# Altium schematic sheet ETHERNET.SchDoc: {Наименование}
size 420 x 297 mm; ApprovedBy: {Утвердил}; CheckedBy: {Проверил}; DrawnBy: {Разраб.}; DocumentNumber: АБВГ 123456.789 00; SheetNumber: 10; SheetTotal: {}; Scale: {Мш.}; PageSetup: Record=PageOptions|CenterHorizontal=False|CenterVertical=False|PrintScale=0.95|XCorrection=0.00|YCorrection=0.00|PrintKind=1|BorderSize=5000000|LeftOffset=0|BottomOffset=0|Orientation=1|PaperLength=1000|PaperWidth=1000|Scale=100|PaperSource=15|PrintQuality=600|MediaType=1|DitherType=10|PaperKind=A4|PrintScaleMode=1; ProcessInspection: {Т.контр.}; Mass: {М.}; NormInspection: {Н.контр.}; Letter1Column: {}; Letter2Column: {}; Letter3Column: {}; DocumentType: {Документ}; Rule: PcbType=ProtelPcb
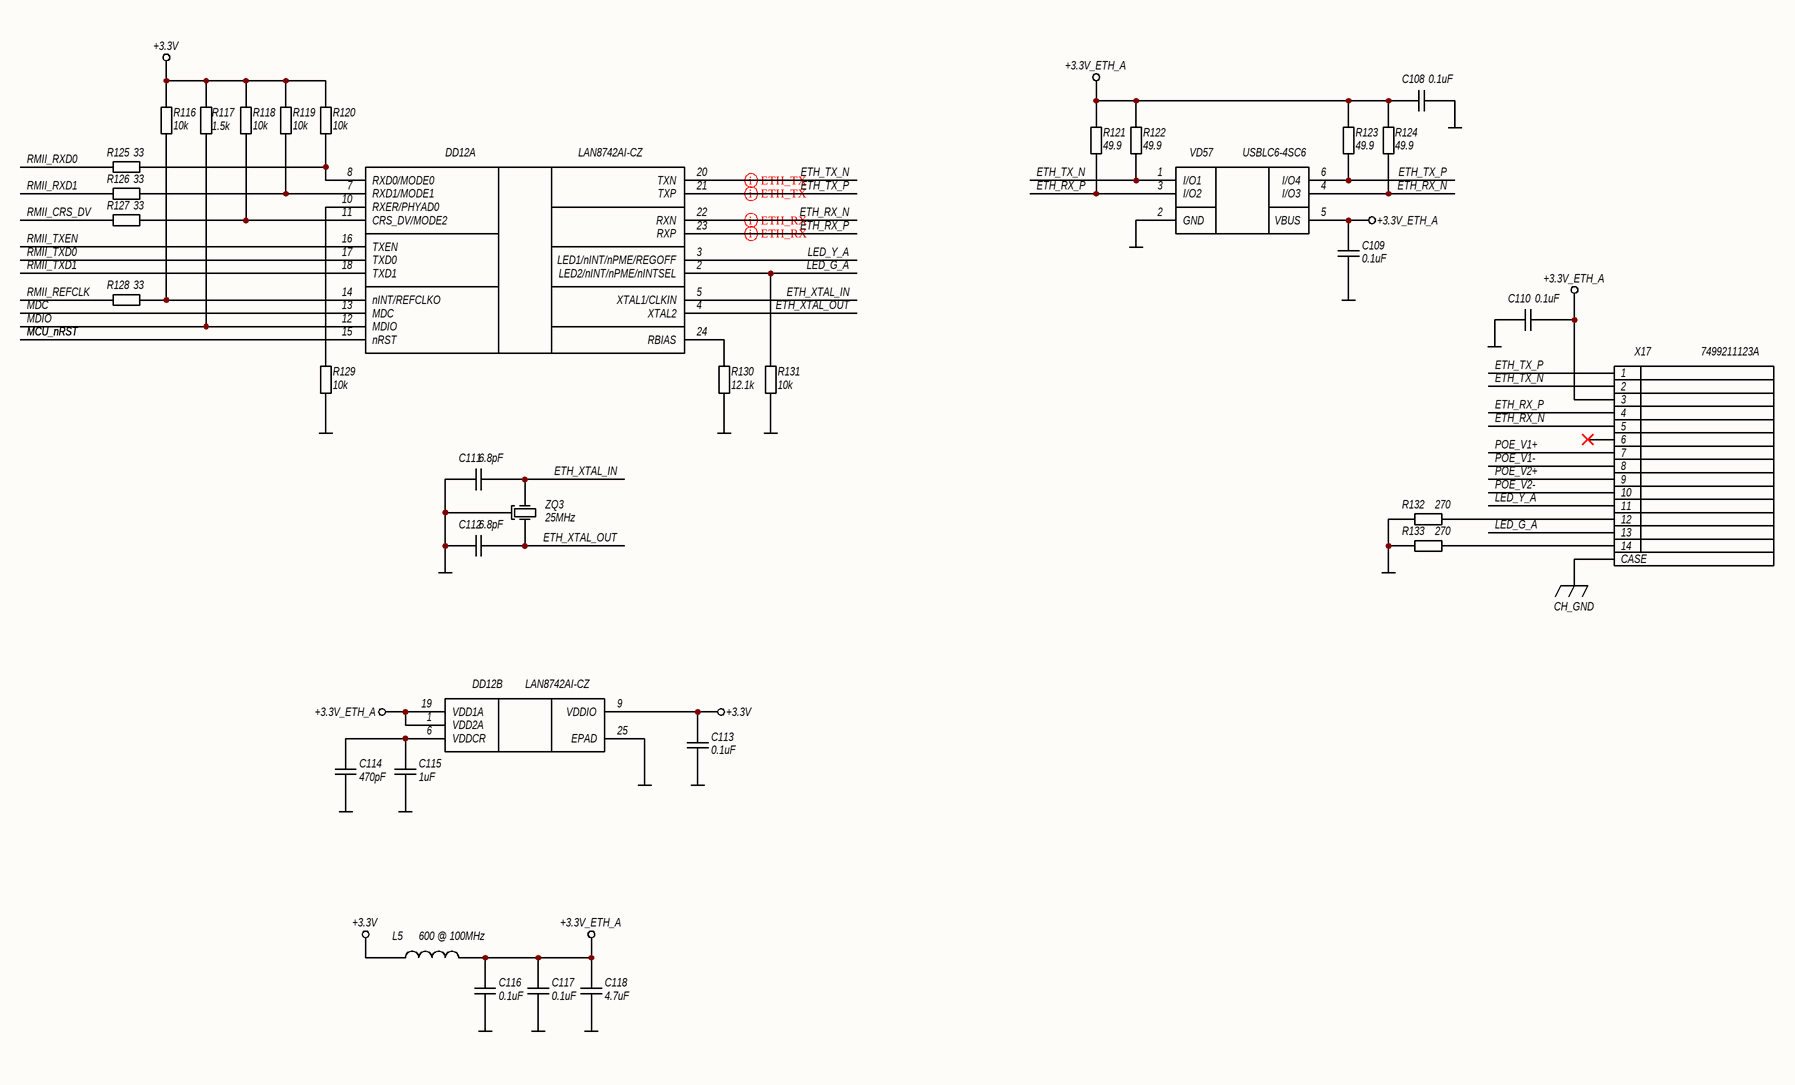
[diagram p0: ETHERNET.SchDoc]

## Parts
C108  0.1uF  [C0603N]
C109  0.1uF  [C0603N]
C110  0.1uF  [C0603N]
C111  6.8pF  [C0603N]
C112  6.8pF  [C0603N]
C113  0.1uF  [C0603N]
C114  470pF  [C0603N]
C115  1uF  [C0603N]
C116  0.1uF  [C0603N]
C117  0.1uF  [C0603N]
C118  4.7uF  [C0603N]
DD12  LAN8742AI-CZ  [S4QFN-24]  (parts A,B of 2)
L5  600 @ 100MHz  [FB0603N]
R116  10k  [R0603N]
R117  1.5k  [R0603N]
R118  10k  [R0603N]
R119  10k  [R0603N]
R120  10k  [R0603N]
R121  49.9  [R0603N]
R122  49.9  [R0603N]
R123  49.9  [R0603N]
R124  49.9  [R0603N]
R125  33  [R0603N]
R126  33  [R0603N]
R127  33  [R0603N]
R128  33  [R0603N]
R129  10k  [R0603N]
R130  12.1k  [R0603N]
R131  10k  [R0603N]
R132  270  [R0603N]
R133  270  [R0603N]
VD57  USBLC6-4SC6  [SOT23-6]
X17  7499211123A  [7499211123A]
ZQ3  25MHz  [NX3225GA]

## Nets
+3.3V: C113.2 DD12.9(VDDIO) L5.1 R116.1 R117.1 R118.1 R119.1 R120.1
+3.3V_ETH_A: C108.2 C109.2 C110.1 C116.2 C117.2 C118.2 DD12.1(VDD2A) DD12.19(VDD1A) L5.2 R121.2 R122.2 R123.2 R124.2 VD57.5(VBUS) X17.3
CH_GND: X17.15(CASE)
GND: C108.1 C109.1 C110.2 C111.2 C112.2 C113.1 C114.1 C115.1 C116.1 C117.1 C118.1 DD12.25(EPAD) R129.1 R130.1 R131.1 R132.1 R133.1 VD57.2(GND) ZQ3.2
ETH_RX_N: DD12.22(RXN) R124.1 VD57.4(I/O3) X17.5
ETH_RX_P: DD12.23(RXP) R121.1 VD57.3(I/O2) X17.4
ETH_TX_N: DD12.20(TXN) R122.1 VD57.1(I/O1) X17.2
ETH_TX_P: DD12.21(TXP) R123.1 VD57.6(I/O4) X17.1
ETH_XTAL_IN: C111.1 DD12.5(XTAL1/CLKIN) ZQ3.1
ETH_XTAL_OUT: C112.1 DD12.4(XTAL2) ZQ3.3
LED_G_A: DD12.2(LED2/nINT/nPME/nINTSEL) R131.2 X17.13
LED_Y_A: DD12.3(LED1/nINT/nPME/REGOFF) X17.11
MCU_nRST: DD12.15(nRST)
MDC: DD12.13(MDC)
MDIO: DD12.12(MDIO) R117.2
POE_V1+: X17.7
POE_V1-: X17.8
POE_V2+: X17.9
POE_V2-: X17.10
RMII_CRS_DV: R127.2
RMII_REFCLK: R128.2
RMII_RXD0: R125.2
RMII_RXD1: R126.2
RMII_TXD0: DD12.17(TXD0)
RMII_TXD1: DD12.18(TXD1)
RMII_TXEN: DD12.16(TXEN)
NetC114_2: C114.2 C115.2 DD12.6(VDDCR)
NetDD12_7: DD12.7(RXD1/MODE1) R119.2 R126.1
NetDD12_8: DD12.8(RXD0/MODE0) R120.2 R125.1
NetDD12_10: DD12.10(RXER/PHYAD0) R129.2
NetDD12_11: DD12.11(CRS_DV/MODE2) R118.2 R127.1
NetDD12_14: DD12.14(nINT/REFCLKO) R116.2 R128.1
NetDD12_24: DD12.24(RBIAS) R130.2
NetR132_2: R132.2 X17.12
NetR133_2: R133.2 X17.14

Not connected (* = marked no-connect by the designer): X17 6*

## Layout directives
differential pair; differential pair class ETH_TX: ETH_TX_N, ETH_TX_P
differential pair; differential pair class ETH_RX: ETH_RX_N, ETH_RX_P

## Notes on the sheet
- Подп. и дата
- Инв. № дубл.
- Взам. инв. №
- Инв. № подл.
- Лист
- Изм.
- № докум.
- Подп.
- Дата
- Копировал
- Формат А3

## Library data of the parts
C108-C110 C113 C116 C117 = CL10B104KB8NNNC: Конденсатор; Точность: 10%; Напряжение: 50V; Диэлектрик: X7R; Производитель: Samsung Electro-Mechanics; Описание: 0.1 µF ±10% 50V Ceramic Capacitor X7R 0603 (1608 Metric); Корпус: 0603 (1608 Metric); Температурный диапазон: -55°C ~ 125°C; Вид монтажа: SMD; Артикул: CL10B104KB8NNNC; Номинал: 0.1uF; Строка для документации: https://mm.digikey.com/Volume0/opasdata/d220001/medias/docus/609/CL10B104KB8NNNC_Spec.pdf; Тип элемента: Конденсатор
C111 C112 = CC0603CRNPO9BN6R8: Конденсатор; Точность: ±0.25pF; Напряжение: 50V; Диэлектрик: NP0; Производитель: YAGEO; Описание: 6.8 pF ±0.25pF 50V Ceramic Capacitor C0G, NP0 0603 (1608 Metric); Корпус: 0603 (1608 Metric); Температурный диапазон: -55°C ~ 125°C; Вид монтажа: SMD; Артикул: CC0603CRNPO9BN6R8; Номинал: 6.8pF; Строка для документации: https://www.yageo.com/upload/media/product/productsearch/datasheet/mlcc/UPY-GP_NP0_16V-to-50V_18.pdf; Тип элемента: Конденсатор
C114 = CL10C471JB8NNNC: Конденсатор; Точность: 5%; Напряжение: 50V; Диэлектрик: NP0; Производитель: Samsung Electro-Mechanics; Описание: 470 pF ±5% 50V Ceramic Capacitor C0G, NP0 0603 (1608 Metric); Корпус: 0603 (1608 Metric); Температурный диапазон: -55°C ~ 125°C; Вид монтажа: SMD; Артикул: CL10C471JB8NNNC; Номинал: 470pF; Строка для документации: https://www.samsungsem.com/resources/file/global/support/product_catalog/MLCC.pdf; Тип элемента: Конденсатор
C115 = CL10B105KO8NNNC: Конденсатор; Точность: 10%; Напряжение: 16V; Диэлектрик: X7R; Производитель: YAGEO; Описание: 1 µF ±10% 16V Ceramic Capacitor X7R 0603 (1608 Metric); Корпус: 0603 (1608 Metric); Температурный диапазон: -55°C ~ 125°C; Вид монтажа: SMD; Артикул: CL10B105KO8NNNC; Номинал: 1uF; Строка для документации: https://weblib.samsungsem.com/mlcc/mlcc-ec-data-sheet.do?partNumber=CL10B105KO8NNN; Тип элемента: Конденсатор
C118 = CL10A475KO8NNNC: Конденсатор; Точность: 10%; Напряжение: 16V; Диэлектрик: X5R; Производитель: Samsung Electro-Mechanics; Описание: 4.7 µF ±10% 16V Ceramic Capacitor X5R 0603 (1608 Metric); Корпус: 0603 (1608 Metric); Температурный диапазон: -55°C ~ 85°C; Вид монтажа: SMD; Артикул: CL10A475KO8NNNC; Номинал: 4.7uF; Строка для документации: https://mm.digikey.com/Volume0/opasdata/d220001/medias/docus/2328/CL10A475KO8NNNC_Spec.pdf; Тип элемента: Конденсатор
DD12 = LAN8742AI-CZ: Микросхема физического уровня Ethernet 10/100, RMII; Производитель: Microchip Technology; Описание: 1/1 Transceiver Full Ethernet 24-SQFN (4x4); Корпус: 24-VFQFN Exposed Pad; Температурный диапазон: -40°C ~ 85°C; Вид монтажа: SMD; Артикул: LAN8742AI-CZ; Строка для документации: https://ww1.microchip.com/downloads/en/DeviceDoc/DS_LAN8742_00001989A.pdf; Тип элемента: Микросхема
L5 = BLM18AG601SN1D: Фильтр ЭМП индуктивный; Ток: 500mA; Сопротивление: 380m; Тип: Ferrite Bead; Производитель: Murata Electronics; Описание: 600 Ohms @ 100 MHz 1 Ferrite Bead 0603 (1608 Metric) 500mA 380mOhm; Корпус: 0603 (1608 Metric); Температурный диапазон: -55°C ~ 125°C; Вид монтажа: SMD; Артикул: BLM18AG601SN1D; Номинал: 600 @ 100MHz; Строка для документации: https://www.murata.com/en-us/products/productdata/8796738650142/ENFA0003.pdf; Тип элемента: Фильтр ЭМП
R116 R118-R120 R129 R131 = RC0603FR-0710KL: Резистор; Точность: 1%; ТКС: ±100ppm/°C; Напряжение: 75V; Производитель: YAGEO; Описание: 10 kOhms ±1% 0.1W, 1/10W Chip Resistor 0603 (1608 Metric) Moisture Resistant Thick Film; Корпус: 0603 (1608 Metric); Температурный диапазон: -55°C ~ 155°C; Вид монтажа: SMD; Артикул: RC0603FR-0710KL; Номинал: 10k; Строка для документации: https://www.yageo.com/upload/media/product/app/datasheet/rchip/pyu-rc_group_51_rohs_l.pdf; Тип элемента: Резистор
R117 = RC0603FR-071K5L: Резистор; Точность: 1%; ТКС: ±100ppm/°C; Напряжение: 75V; Производитель: YAGEO; Описание: 1.5 kOhms ±1% 0.1W, 1/10W Chip Resistor 0603 (1608 Metric) Moisture Resistant Thick Film; Корпус: 0603 (1608 Metric); Температурный диапазон: -55°C ~ 155°C; Вид монтажа: SMD; Артикул: RC0603FR-071K5L; Номинал: 1.5k; Строка для документации: https://www.yageo.com/upload/media/product/app/datasheet/rchip/pyu-rc_group_51_rohs_l.pdf; Тип элемента: Резистор
R121-R124 = RC0603FR-0749R9L: Резистор; Точность: 1%; ТКС: ±100ppm/°C; Напряжение: 75V; Производитель: YAGEO; Описание: 49.9 Ohms ±1% 0.1W, 1/10W Chip Resistor 0603 (1608 Metric) Moisture Resistant Thick Film; Корпус: 0603 (1608 Metric); Температурный диапазон: -55°C ~ 155°C; Вид монтажа: SMD; Артикул: RC0603FR-0749R9L; Номинал: 49.9; Строка для документации: https://www.yageo.com/upload/media/product/app/datasheet/rchip/pyu-rc_group_51_rohs_l.pdf; Тип элемента: Резистор
R125-R128 = RC0603FR-0733RL: Резистор; Точность: 1%; ТКС: ±100ppm/°C; Напряжение: 75V; Производитель: YAGEO; Описание: 33 Ohms ±1% 0.1W, 1/10W Chip Resistor 0603 (1608 Metric) Moisture Resistant Thick Film; Корпус: 0603 (1608 Metric); Температурный диапазон: -55°C ~ 155°C; Вид монтажа: SMD; Артикул: RC0603FR-0733RL; Номинал: 33; Строка для документации: https://www.yageo.com/upload/media/product/app/datasheet/rchip/pyu-rc_group_51_rohs_l.pdf; Тип элемента: Резистор
R130 = RC0603FR-0712K1L: Резистор; Точность: 1%; ТКС: ±100ppm/°C; Напряжение: 75V; Производитель: YAGEO; Описание: 12.1 kOhms ±1% 0.1W, 1/10W Chip Resistor 0603 (1608 Metric) Moisture Resistant Thick Film; Корпус: 0603 (1608 Metric); Температурный диапазон: -55°C ~ 155°C; Вид монтажа: SMD; Артикул: RC0603FR-0712K1L; Номинал: 12.1k; Строка для документации: https://www.yageo.com/upload/media/product/app/datasheet/rchip/pyu-rc_group_51_rohs_l.pdf; Тип элемента: Резистор
R132 R133 = RC0603FR-07270RL: Резистор; Точность: 1%; ТКС: ±100ppm/°C; Напряжение: 75V; Производитель: YAGEO; Описание: 270 Ohms ±1% 0.1W, 1/10W Chip Resistor 0603 (1608 Metric) Moisture Resistant Thick Film; Корпус: 0603 (1608 Metric); Температурный диапазон: -55°C ~ 155°C; Вид монтажа: SMD; Артикул: RC0603FR-07270RL; Номинал: 270; Строка для документации: https://www.yageo.com/upload/media/product/app/datasheet/rchip/pyu-rc_group_51_rohs_l.pdf; Тип элемента: Резистор
VD57 = USBLC6-4SC6: Сборка TVS диодов, 4-канальная; Напряжение: 5.25V; Напряжение ограничения: 17V; Напряжение пробоя: 6V; Ток: 5A; Тип: TVS Unidirectional; Производитель: STMicroelectronics; Описание: 17V Clamp 5A (8/20µs) Ipp Tvs Diode Surface Mount SOT-23-6; Корпус: SOT-23-6; Температурный диапазон: -40°C ~ 125°C (TJ); Вид монтажа: SMD; Тип элемента: Диод защитны; Артикул: USBLC6-4SC6; Строка для документации: https://www.st.com/content/ccc/resource/technical/document/datasheet/9a/e6/1c/4f/b6/9a/44/e6/CD00047494.pdf/files/CD00047494.pdf/jcr:content/translations/en.CD00047494.pdf
X17 = 7499211123A: Разъем, 14 контактов+корпус; Тип разъема: Modular Connector with Magnetics; Количество контактов: 8; Шаг контактов: 0.635mm; Производитель: Würth Elektronik; Описание: 1 Port RJ45Through Hole 10/100 Base-T, AutoMDIX, Power over Ethernet (PoE); Температурный диапазон: 0°C ~ 70°C; Вид монтажа: SMD; Артикул: 7499211123A; Строка для документации: https://www.we-online.com/katalog/datasheet/7499211123A.pdf; Тип элемента: Разъем
ZQ3 = NX3225GA-25.000M: Кварцевый резонатор, экранированный; Точность: ±20ppm; Описание: 25 MHz ±20ppm Crystal 8pF 50 Ohms 4-SMD, No Lead; Тип: MHz Crystal; Производитель: NDK America, Inc.; Температурный диапазон: -40°C ~ 85°C; Корпус: 3.20mm x 2.50mm; Вид монтажа: SMD; Артикул: NX3225GA-25.000M; Частота: 25MHz; Строка для документации: https://www.ndk.com/en/products/upload/lineup/pdf/NDKX03-00006_en.pdf; Тип элемента: Кварцевый резонатор